# EAGLE design WT_ControlBoard (EAGLE 7.2.0)

## Sheet 1 of 5: Outpus
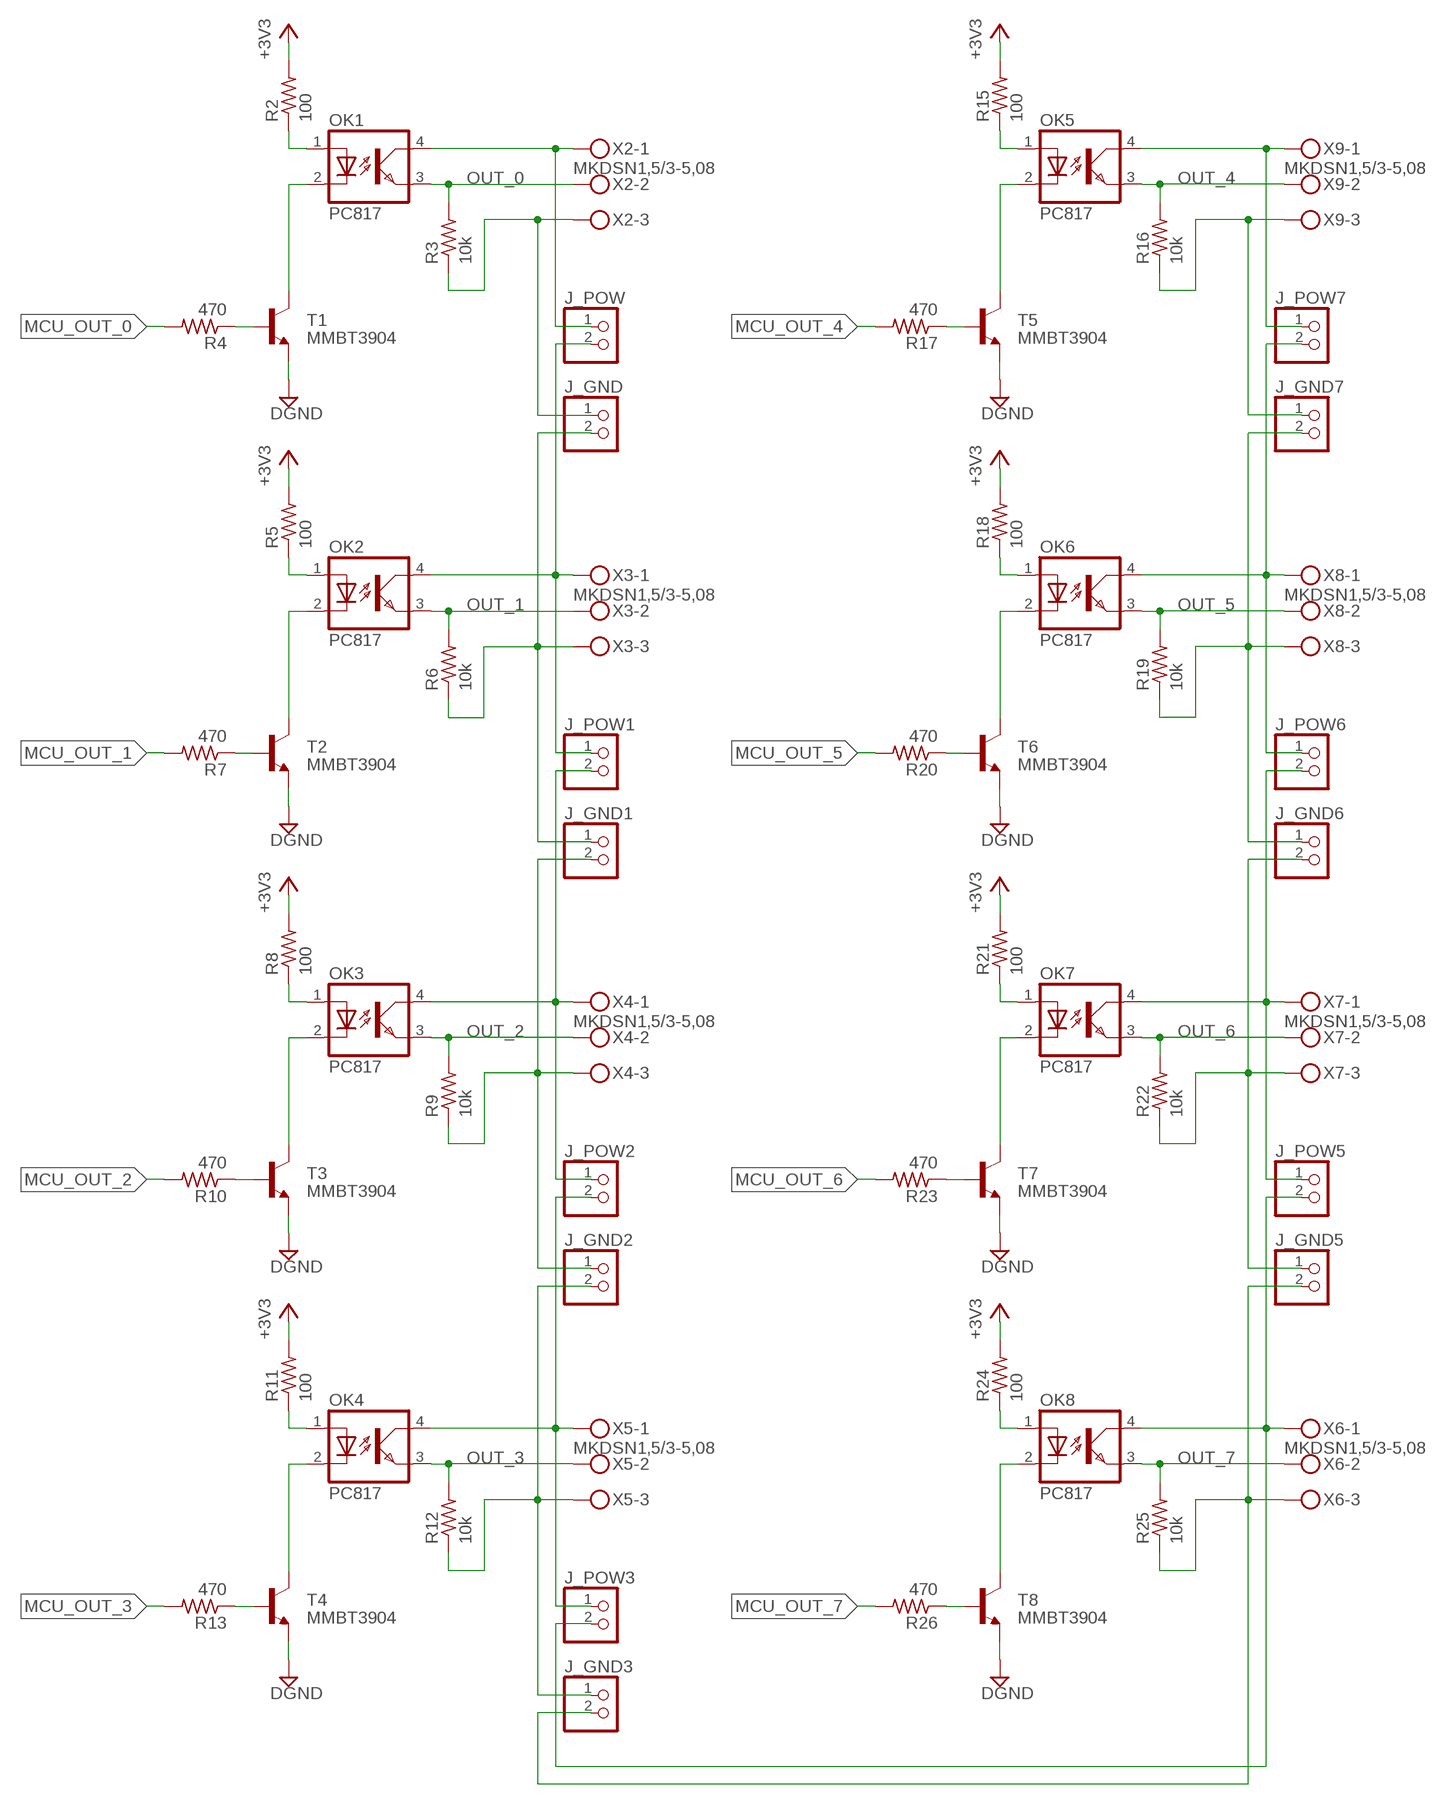
[diagram p0: schematic, sheet 1]

### Parts
J_GND  PINHD-1X2  [1X02]
J_GND1  PINHD-1X2  [1X02]
J_GND2  PINHD-1X2  [1X02]
J_GND3  PINHD-1X2  [1X02]
J_GND5  PINHD-1X2  [1X02]
J_GND6  PINHD-1X2  [1X02]
J_GND7  PINHD-1X2  [1X02]
J_POW  PINHD-1X2  [1X02]
J_POW1  PINHD-1X2  [1X02]
J_POW2  PINHD-1X2  [1X02]
J_POW3  PINHD-1X2  [1X02]
J_POW5  PINHD-1X2  [1X02]
J_POW6  PINHD-1X2  [1X02]
J_POW7  PINHD-1X2  [1X02]
OK1  PC817  [DIL04]
OK2  PC817  [DIL04]
OK3  PC817  [DIL04]
OK4  PC817  [DIL04]
OK5  PC817  [DIL04]
OK6  PC817  [DIL04]
OK7  PC817  [DIL04]
OK8  PC817  [DIL04]
R2  100  R-US_R0402  [R0402]
R3  10k  R-US_R0402  [R0402]
R4  470  R-US_0204/5  [0204/5]
R5  100  R-US_R0402  [R0402]
R6  10k  R-US_R0402  [R0402]
R7  470  R-US_0204/5  [0204/5]
R8  100  R-US_R0402  [R0402]
R9  10k  R-US_R0402  [R0402]
R10  470  R-US_0204/5  [0204/5]
R11  100  R-US_R0402  [R0402]
R12  10k  R-US_R0402  [R0402]
R13  470  R-US_0204/5  [0204/5]
R15  100  R-US_R0402  [R0402]
R16  10k  R-US_R0402  [R0402]
R17  470  R-US_0204/7  [0204/7]
R18  100  R-US_R0402  [R0402]
R19  10k  R-US_R0402  [R0402]
R20  470  R-US_0204/5  [0204/5]
R21  100  R-US_R0402  [R0402]
R22  10k  R-US_R0402  [R0402]
R23  470  R-US_0204/5  [0204/5]
R24  100  R-US_R0402  [R0402]
R25  10k  R-US_R0402  [R0402]
R26  470  R-US_0204/5  [0204/5]
T1  MMBT3904  MMBT3904LT1-NPN-SOT23-BEC  [SOT23-BEC]
T2  MMBT3904  MMBT3904LT1-NPN-SOT23-BEC  [SOT23-BEC]
T3  MMBT3904  MMBT3904LT1-NPN-SOT23-BEC  [SOT23-BEC]
T4  MMBT3904  MMBT3904LT1-NPN-SOT23-BEC  [SOT23-BEC]
T5  MMBT3904  MMBT3904LT1-NPN-SOT23-BEC  [SOT23-BEC]
T6  MMBT3904  MMBT3904LT1-NPN-SOT23-BEC  [SOT23-BEC]
T7  MMBT3904  MMBT3904LT1-NPN-SOT23-BEC  [SOT23-BEC]
T8  MMBT3904  MMBT3904LT1-NPN-SOT23-BEC  [SOT23-BEC]
X2  MKDSN1,5/3-5,08  [MKDSN1,5/3-5,08]
X3  MKDSN1,5/3-5,08  [MKDSN1,5/3-5,08]
X4  MKDSN1,5/3-5,08  [MKDSN1,5/3-5,08]
X5  MKDSN1,5/3-5,08  [MKDSN1,5/3-5,08]
X6  MKDSN1,5/3-5,08  [MKDSN1,5/3-5,08]
X7  MKDSN1,5/3-5,08  [MKDSN1,5/3-5,08]
X8  MKDSN1,5/3-5,08  [MKDSN1,5/3-5,08]
X9  MKDSN1,5/3-5,08  [MKDSN1,5/3-5,08]

### Nets
+3V3: R2.2 R5.2 R8.2 R11.2 R15.2 R18.2 R21.2 R24.2 ; also sheet 2,3,5
DGND: T1.E T2.E T3.E T4.E T5.E T6.E T7.E T8.E ; also sheet 2,3,4,5
MCU_OUT_0: R4.2 ; also sheet 5
MCU_OUT_1: R7.2 ; also sheet 5
MCU_OUT_2: R10.2 ; also sheet 5
MCU_OUT_3: R13.2 ; also sheet 5
MCU_OUT_4: R17.2 ; also sheet 5
MCU_OUT_5: R20.2 ; also sheet 5
MCU_OUT_6: R23.2 ; also sheet 5
MCU_OUT_7: R26.2 ; also sheet 5
N$1: OK1.2(C) T1.C
N$2: OK2.2(C) T2.C
N$3: R4.1 T1.B
N$4: OK1.1(A) R2.1
N$5: R7.1 T2.B
N$6: OK2.1(A) R5.1
N$7: OK3.2(C) T3.C
N$8: R10.1 T3.B
N$9: OK3.1(A) R8.1
N$10: OK4.2(C) T4.C
N$11: R13.1 T4.B
N$12: OK4.1(A) R11.1
N$13: OK5.2(C) T5.C
N$14: R17.1 T5.B
N$15: OK5.1(A) R15.1
N$16: OK6.2(C) T6.C
N$17: R20.1 T6.B
N$18: OK6.1(A) R18.1
N$19: OK7.2(C) T7.C
N$20: R23.1 T7.B
N$21: OK7.1(A) R21.1
N$22: OK8.2(C) T8.C
N$23: R26.1 T8.B
N$24: OK8.1(A) R24.1
N$70: J_GND6.1 J_GND7.2 R19.1 X8.3
N$76: J_GND.1 R3.1 X2.3
N$77: J_GND1.1 J_GND.2 R6.1 X3.3
N$78: J_POW1.1 J_POW.2 OK2.4(COL) X3.1
N$79: J_POW1.2 J_POW2.1 OK3.4(COL) X4.1
N$80: J_GND1.2 J_GND2.1 R9.1 X4.3
N$81: J_POW2.2 J_POW3.1 OK4.4(COL) X5.1
N$82: J_GND2.2 J_GND3.1 R12.1 X5.3
N$85: J_GND3.2 J_GND5.2 R25.1 X6.3
N$86: J_POW3.2 J_POW5.2 OK8.4(COL) X6.1
N$87: J_POW5.1 J_POW6.2 OK7.4(COL) X7.1
N$88: J_GND5.1 J_GND6.2 R22.1 X7.3
N$89: J_POW6.1 J_POW7.2 OK6.4(COL) X8.1
N$90: J_POW7.1 OK5.4(COL) X9.1
N$94: J_GND7.1 R16.1 X9.3
N$101: J_POW.1 OK1.4(COL) X2.1
OUT_0: OK1.3(EMIT) R3.2 X2.2
OUT_1: OK2.3(EMIT) R6.2 X3.2
OUT_2: OK3.3(EMIT) R9.2 X4.2
OUT_3: OK4.3(EMIT) R12.2 X5.2
OUT_4: OK5.3(EMIT) R16.2 X9.2
OUT_5: OK6.3(EMIT) R19.2 X8.2
OUT_6: OK7.3(EMIT) R22.2 X7.2
OUT_7: OK8.3(EMIT) R25.2 X6.2

## Sheet 2 of 5: Inputs
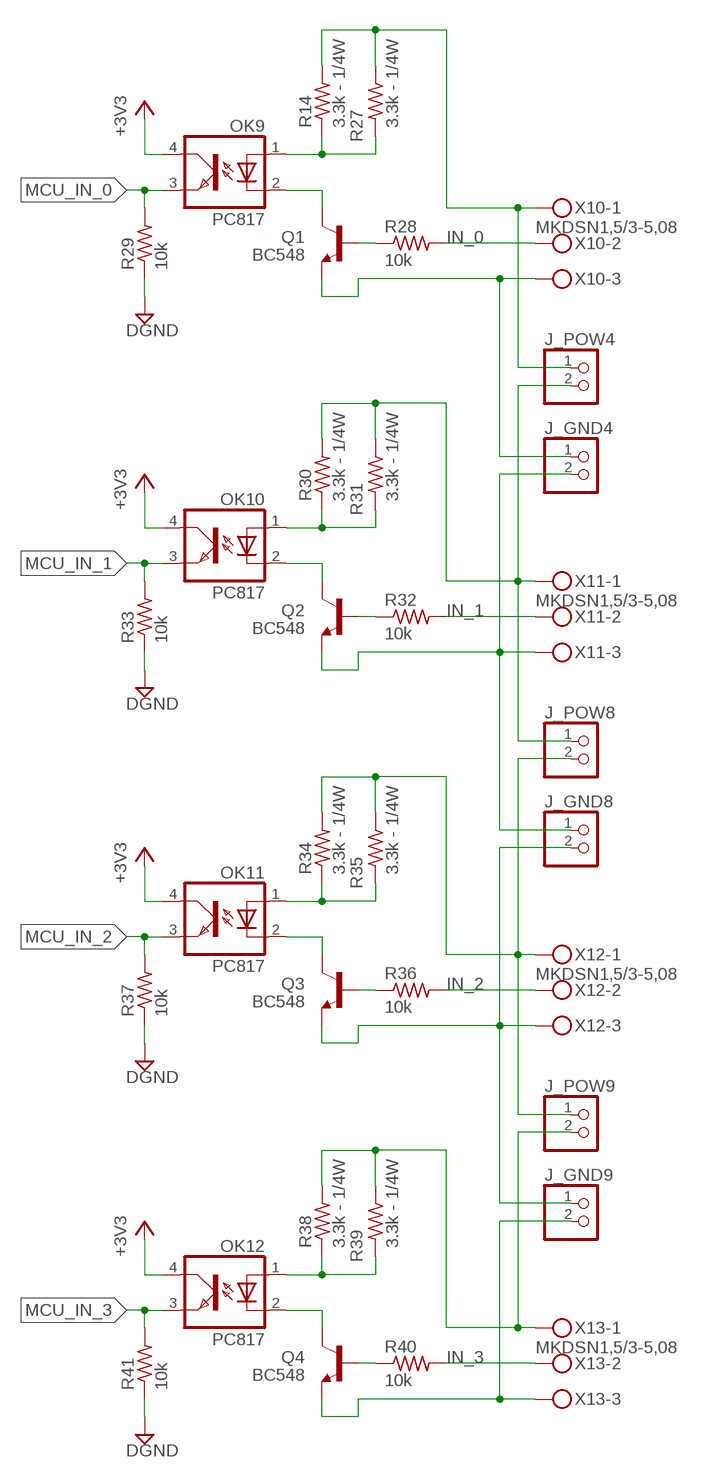
[diagram p1: schematic, sheet 2]

### Parts
J_GND4  PINHD-1X2  [1X02]
J_GND8  PINHD-1X2  [1X02]
J_GND9  PINHD-1X2  [1X02]
J_POW4  PINHD-1X2  [1X02]
J_POW8  PINHD-1X2  [1X02]
J_POW9  PINHD-1X2  [1X02]
OK9  PC817  [DIL04]
OK10  PC817  [DIL04]
OK11  PC817  [DIL04]
OK12  PC817  [DIL04]
Q1  BC548  [TO92-EBC]
Q2  BC548  [TO92-EBC]
Q3  BC548  [TO92-EBC]
Q4  BC548  [TO92-EBC]
R14  3.3k - 1/4W  R-US_0204/2V  [0204V]
R27  3.3k - 1/4W  R-US_0204/2V  [0204V]
R28  10k  R-US_0204/5  [0204/5]
R29  10k  R-US_R0402  [R0402]
R30  3.3k - 1/4W  R-US_0204/2V  [0204V]
R31  3.3k - 1/4W  R-US_0204/2V  [0204V]
R32  10k  R-US_0204/5  [0204/5]
R33  10k  R-US_R0402  [R0402]
R34  3.3k - 1/4W  R-US_0204/2V  [0204V]
R35  3.3k - 1/4W  R-US_0204/2V  [0204V]
R36  10k  R-US_0204/5  [0204/5]
R37  10k  R-US_R0402  [R0402]
R38  3.3k - 1/4W  R-US_0204/2V  [0204V]
R39  3.3k - 1/4W  R-US_0204/2V  [0204V]
R40  10k  R-US_0204/5  [0204/5]
R41  10k  R-US_R0402  [R0402]
X10  MKDSN1,5/3-5,08  [MKDSN1,5/3-5,08]
X11  MKDSN1,5/3-5,08  [MKDSN1,5/3-5,08]
X12  MKDSN1,5/3-5,08  [MKDSN1,5/3-5,08]
X13  MKDSN1,5/3-5,08  [MKDSN1,5/3-5,08]

### Nets
+3V3: OK9.4(COL) OK10.4(COL) OK11.4(COL) OK12.4(COL) ; also sheet 1,3,5
DGND: R29.1 R33.1 R37.1 R41.1 ; also sheet 1,3,4,5
IN_0: R28.2 X10.2
IN_1: R32.2 X11.2
IN_2: R36.2 X12.2
IN_3: R40.2 X13.2
MCU_IN_0: OK9.3(EMIT) R29.2 ; also sheet 5
MCU_IN_1: OK10.3(EMIT) R33.2 ; also sheet 5
MCU_IN_2: OK11.3(EMIT) R37.2 ; also sheet 5
MCU_IN_3: OK12.3(EMIT) R41.2 ; also sheet 5
N$25: OK9.1(A) R14.1 R27.2
N$26: OK9.2(C) Q1.C
N$27: Q1.B R28.1
N$28: OK10.1(A) R30.1 R31.2
N$29: OK10.2(C) Q2.C
N$30: Q2.B R32.1
N$31: OK11.1(A) R34.1 R35.2
N$32: OK11.2(C) Q3.C
N$33: Q3.B R36.1
N$34: OK12.1(A) R38.1 R39.2
N$35: OK12.2(C) Q4.C
N$36: Q4.B R40.1
N$83: J_GND4.2 J_GND8.1 Q2.E X11.3
N$84: J_GND9.2 Q4.E X13.3
N$91: J_POW9.2 R38.2 R39.1 X13.1
N$92: J_POW4.2 J_POW8.1 R30.2 R31.1 X11.1
N$93: J_GND8.2 J_GND9.1 Q3.E X12.3
N$95: J_POW8.2 J_POW9.1 R34.2 R35.1 X12.1
N$96: J_GND4.1 Q1.E X10.3
N$97: J_POW4.1 R14.2 R27.1 X10.1

## Sheet 3 of 5: Bidirectional
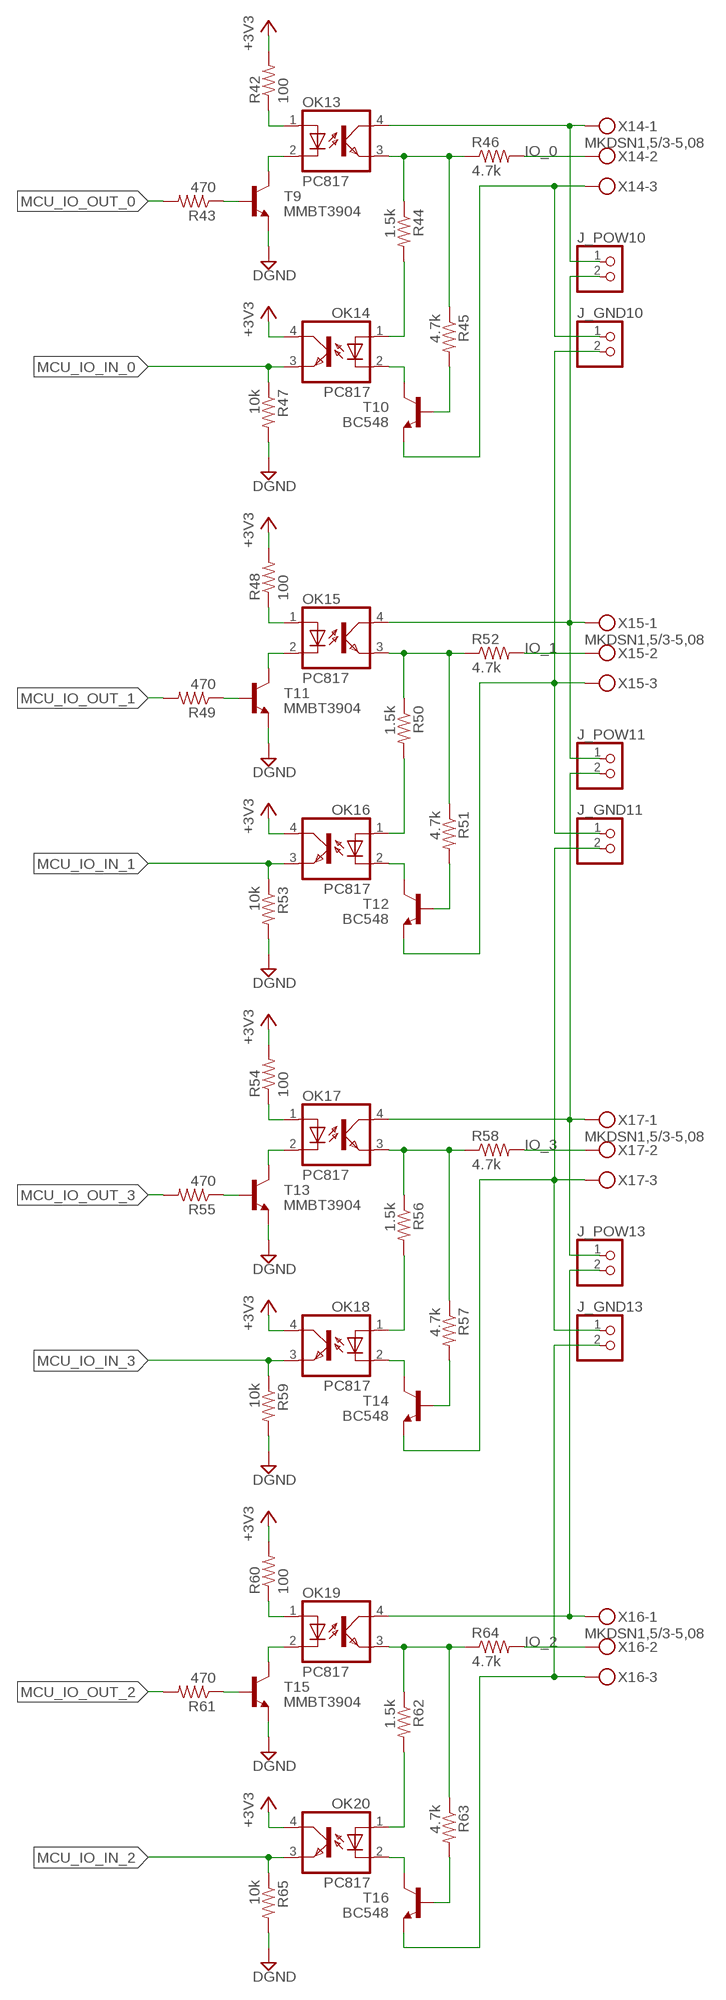
[diagram p2: schematic, sheet 3]

### Parts
J_GND10  PINHD-1X2  [1X02]
J_GND11  PINHD-1X2  [1X02]
J_GND13  PINHD-1X2  [1X02]
J_POW10  PINHD-1X2  [1X02]
J_POW11  PINHD-1X2  [1X02]
J_POW13  PINHD-1X2  [1X02]
OK13  PC817  [DIL04]
OK14  PC817  [DIL04]
OK15  PC817  [DIL04]
OK16  PC817  [DIL04]
OK17  PC817  [DIL04]
OK18  PC817  [DIL04]
OK19  PC817  [DIL04]
OK20  PC817  [DIL04]
R42  100  R-US_0204/7  [0204/7]
R43  470  R-US_R0402  [R0402]
R44  1.5k  R-US_0204/5  [0204/5]
R45  4.7k  R-US_0204/2V  [0204V]
R46  4.7k  R-US_0204/2V  [0204V]
R47  10k  R-US_0204/5  [0204/5]
R48  100  R-US_0204/7  [0204/7]
R49  470  R-US_R0402  [R0402]
R50  1.5k  R-US_0204/5  [0204/5]
R51  4.7k  R-US_0204/2V  [0204V]
R52  4.7k  R-US_0204/2V  [0204V]
R53  10k  R-US_0204/5  [0204/5]
R54  100  R-US_0204/7  [0204/7]
R55  470  R-US_R0402  [R0402]
R56  1.5k  R-US_0204/5  [0204/5]
R57  4.7k  R-US_0204/2V  [0204V]
R58  4.7k  R-US_0204/2V  [0204V]
R59  10k  R-US_0204/5  [0204/5]
R60  100  R-US_0204/7  [0204/7]
R61  470  R-US_R0402  [R0402]
R62  1.5k  R-US_0204/5  [0204/5]
R63  4.7k  R-US_0204/2V  [0204V]
R64  4.7k  R-US_0204/2V  [0204V]
R65  10k  R-US_0204/5  [0204/5]
T9  MMBT3904  MMBT3904LT1-NPN-SOT23-BEC  [SOT23-BEC]
T10  BC548  BC548-NPN-TO92-CBE  [TO92-CBE]
T11  MMBT3904  MMBT3904LT1-NPN-SOT23-BEC  [SOT23-BEC]
T12  BC548  BC548-NPN-TO92-CBE  [TO92-CBE]
T13  MMBT3904  MMBT3904LT1-NPN-SOT23-BEC  [SOT23-BEC]
T14  BC548  BC548-NPN-TO92-CBE  [TO92-CBE]
T15  MMBT3904  MMBT3904LT1-NPN-SOT23-BEC  [SOT23-BEC]
T16  BC548  BC548-NPN-TO92-CBE  [TO92-CBE]
X14  MKDSN1,5/3-5,08  [MKDSN1,5/3-5,08]
X15  MKDSN1,5/3-5,08  [MKDSN1,5/3-5,08]
X16  MKDSN1,5/3-5,08  [MKDSN1,5/3-5,08]
X17  MKDSN1,5/3-5,08  [MKDSN1,5/3-5,08]

### Nets
+3V3: OK14.4(COL) OK16.4(COL) OK18.4(COL) OK20.4(COL) R42.2 R48.2 R54.2 R60.2 ; also sheet 1,2,5
DGND: R47.2 R53.2 R59.2 R65.2 T9.E T11.E T13.E T15.E ; also sheet 1,2,4,5
IO_0: R46.2 X14.2
IO_1: R52.2 X15.2
IO_2: R64.2 X16.2
IO_3: R58.2 X17.2
MCU_IO_IN_0: OK14.3(EMIT) R47.1 ; also sheet 5
MCU_IO_IN_1: OK16.3(EMIT) R53.1 ; also sheet 5
MCU_IO_IN_2: OK20.3(EMIT) R65.1 ; also sheet 5
MCU_IO_IN_3: OK18.3(EMIT) R59.1 ; also sheet 5
MCU_IO_OUT_0: R43.2 ; also sheet 5
MCU_IO_OUT_1: R49.2 ; also sheet 5
MCU_IO_OUT_2: R61.2 ; also sheet 5
MCU_IO_OUT_3: R55.2 ; also sheet 5
N$37: OK14.2(C) T10.C
N$38: OK13.2(C) T9.C
N$39: R43.1 T9.B
N$40: OK13.1(A) R42.1
N$41: OK13.3(EMIT) R44.1 R45.1 R46.1
N$42: OK14.1(A) R44.2
N$43: R45.2 T10.B
N$44: OK16.2(C) T12.C
N$45: OK15.2(C) T11.C
N$46: R49.1 T11.B
N$47: OK15.1(A) R48.1
N$48: OK15.3(EMIT) R50.1 R51.1 R52.1
N$49: OK16.1(A) R50.2
N$50: R51.2 T12.B
N$51: OK18.2(C) T14.C
N$52: OK17.2(C) T13.C
N$53: R55.1 T13.B
N$54: OK17.1(A) R54.1
N$55: OK17.3(EMIT) R56.1 R57.1 R58.1
N$56: OK18.1(A) R56.2
N$57: R57.2 T14.B
N$58: OK20.2(C) T16.C
N$59: OK19.2(C) T15.C
N$60: R61.1 T15.B
N$61: OK19.1(A) R60.1
N$62: OK19.3(EMIT) R62.1 R63.1 R64.1
N$63: OK20.1(A) R62.2
N$64: R63.2 T16.B
N$98: J_POW11.2 J_POW13.1 OK17.4(COL) X17.1
N$99: J_GND13.2 T16.E X16.3
N$100: J_POW10.1 OK13.4(COL) X14.1
N$102: J_GND10.1 T10.E X14.3
N$103: J_POW10.2 J_POW11.1 OK15.4(COL) X15.1
N$104: J_GND10.2 J_GND11.1 T12.E X15.3
N$105: J_GND11.2 J_GND13.1 T14.E X17.3
N$106: J_POW13.2 OK19.4(COL) X16.1

## Sheet 4 of 5: Analog IO
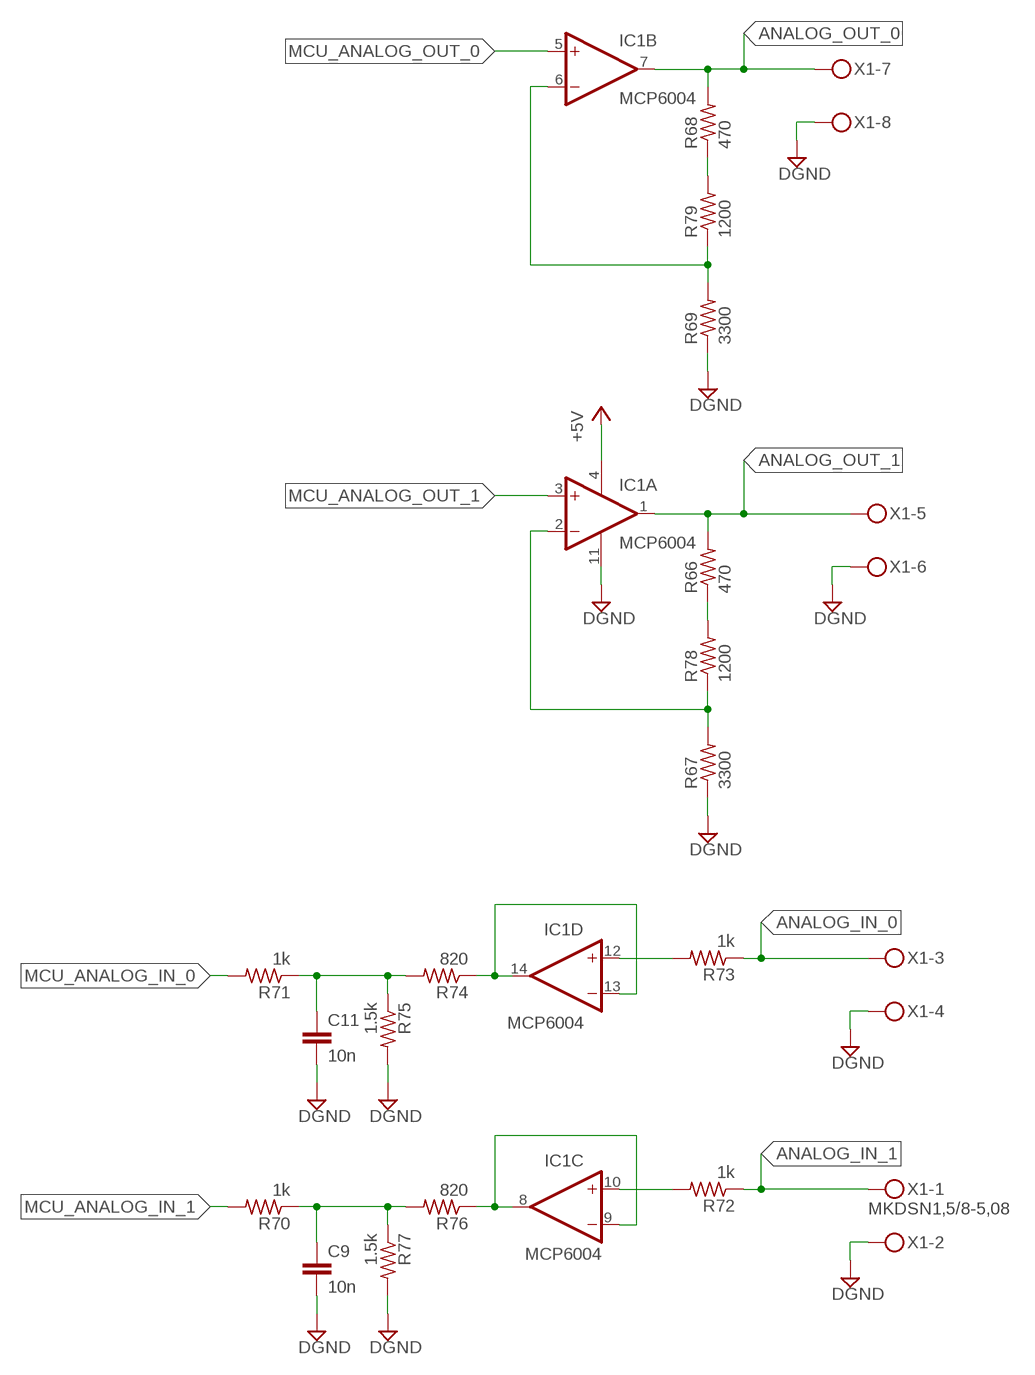
[diagram p3: schematic, sheet 4]

### Parts
C9  10n  C-EUC0402  [C0402]
C11  10n  C-EUC0402  [C0402]
IC1  MCP6004  LM324D  [SO14]
R66  470  R-US_R0402  [R0402]
R67  3300  R-US_R0402  [R0402]
R68  470  R-US_R0402  [R0402]
R69  3300  R-US_R0402  [R0402]
R70  1k  R-US_R0402  [R0402]
R71  1k  R-US_R0402  [R0402]
R72  1k  R-US_0204/2V  [0204V]
R73  1k  R-US_0204/7  [0204/7]
R74  820  R-US_R0402  [R0402]
R75  1.5k  R-US_R0402  [R0402]
R76  820  R-US_R0402  [R0402]
R77  1.5k  R-US_R0402  [R0402]
R78  1200  R-US_R0402  [R0402]
R79  1200  R-US_R0402  [R0402]
X1  MKDSN1,5/8-5,08  [MKDSN1,5/8-5,08]

### Nets
+5V: IC1.4(P:V+) ; also sheet 5
ANALOG_IN_0: R73.1 X1.3
ANALOG_IN_1: R72.1 X1.1
ANALOG_OUT_0: IC1.7(B:OUT) R68.2 X1.7
ANALOG_OUT_1: IC1.1(A:OUT) R66.2 X1.5
DGND: C9.2 C11.2 IC1.11(P:V-) R67.1 R69.1 R75.2 R77.2 X1.2 X1.4 X1.6 X1.8 ; also sheet 1,2,3,5
MCU_ANALOG_IN_0: R71.2 ; also sheet 5
MCU_ANALOG_IN_1: R70.2 ; also sheet 5
MCU_ANALOG_OUT_0: IC1.5(B:+IN) ; also sheet 5
MCU_ANALOG_OUT_1: IC1.3(A:+IN) ; also sheet 5
N$65: IC1.6(B:-IN) R69.2 R79.1
N$66: IC1.2(A:-IN) R67.2 R78.1
N$67: IC1.10(C:+IN) R72.2
N$68: IC1.12(D:+IN) R73.2
N$69: IC1.8(C:OUT) IC1.9(C:-IN) R76.1
N$71: IC1.13(D:-IN) IC1.14(D:OUT) R74.1
N$72: C9.1 R70.1 R76.2 R77.1
N$73: C11.1 R71.1 R74.2 R75.1
N$74: R66.1 R78.2
N$75: R68.1 R79.2

## Sheet 5 of 5: Power
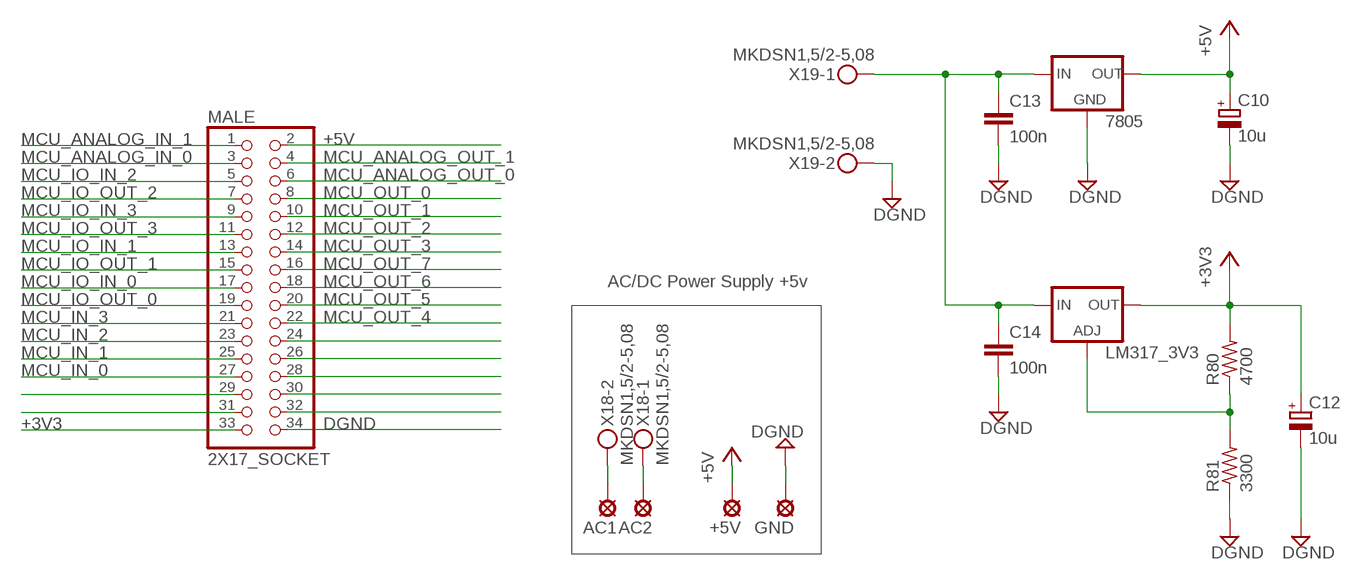
[diagram p4: schematic, sheet 5]

### Parts
7805  78XXS  [78XXS]
+5V  LSP10  [LSP10]
AC1  LSP10  [LSP10]
AC2  LSP10  [LSP10]
C10  10u  CPOL-EUE1.8-4  [E1,8-4]
C12  10u  CPOL-EUE1.8-4  [E1,8-4]
C13  100n  C-EUC1206  [C1206]
C14  100n  C-EUC1206  [C1206]
GND  LSP10  [LSP10]
LM317_3V3  LM317TS  [317TS]
MALE  2X17_SOCKET  [2X17_SOCKET]
R80  4700  R-US_0204/2V  [0204V]
R81  3300  R-US_0204/2V  [0204V]
X18  MKDSN1,5/2-5,08  [MKDSN1,5/2-5,08]
X19  MKDSN1,5/2-5,08  [MKDSN1,5/2-5,08]

### Nets
+3V3: C12.+ LM317_3V3.2(OUT) MALE.33 R80.2 ; also sheet 1,2,3
+5V: 7805.OUT +5V.MP C10.+ MALE.2 ; also sheet 4
DGND: 7805.GND C10.- C12.- C13.2 C14.2 GND.MP MALE.34 R81.1 X19.2 ; also sheet 1,2,3,4
MCU_ANALOG_IN_0: MALE.3 ; also sheet 4
MCU_ANALOG_IN_1: MALE.1 ; also sheet 4
MCU_ANALOG_OUT_0: MALE.6 ; also sheet 4
MCU_ANALOG_OUT_1: MALE.4 ; also sheet 4
MCU_IN_0: MALE.27 ; also sheet 2
MCU_IN_1: MALE.25 ; also sheet 2
MCU_IN_2: MALE.23 ; also sheet 2
MCU_IN_3: MALE.21 ; also sheet 2
MCU_IO_IN_0: MALE.17 ; also sheet 3
MCU_IO_IN_1: MALE.13 ; also sheet 3
MCU_IO_IN_2: MALE.5 ; also sheet 3
MCU_IO_IN_3: MALE.9 ; also sheet 3
MCU_IO_OUT_0: MALE.19 ; also sheet 3
MCU_IO_OUT_1: MALE.15 ; also sheet 3
MCU_IO_OUT_2: MALE.7 ; also sheet 3
MCU_IO_OUT_3: MALE.11 ; also sheet 3
MCU_OUT_0: MALE.8 ; also sheet 1
MCU_OUT_1: MALE.10 ; also sheet 1
MCU_OUT_2: MALE.12 ; also sheet 1
MCU_OUT_3: MALE.14 ; also sheet 1
MCU_OUT_4: MALE.22 ; also sheet 1
MCU_OUT_5: MALE.20 ; also sheet 1
MCU_OUT_6: MALE.18 ; also sheet 1
MCU_OUT_7: MALE.16 ; also sheet 1
N$107: AC1.MP X18.2
N$108: AC2.MP X18.1
N$110: 7805.IN C13.1 C14.1 LM317_3V3.3(IN) X19.1
N$111: LM317_3V3.1(ADJ) R80.1 R81.2
N$123: MALE.29
N$124: MALE.31
N$137: MALE.24
N$138: MALE.26
N$139: MALE.28
N$140: MALE.30
N$141: MALE.32

### Notes on the sheet
- AC/DC Power Supply +5v

## Library data of the parts
7805 = v-reg:78XXS: VOLTAGE REGULATOR
+5V AC1 AC2 GND = solpad:LSP10: SOLDER PAD drill 1.0 mm, distributor Buerklin, 12H555
C9 C11 C13 C14 = rcl:C-EU: CAPACITOR, European symbol
C10 C12 = rcl:CPOL-EU: POLARIZED CAPACITOR, European symbol
IC1 = linear:LM324: OP AMP
J_GND J_GND1-J_GND11 J_GND13 J_POW J_POW1-J_POW11 J_POW13 = pinhead:PINHD-1X2: PIN HEADER
LM317_3V3 = v-reg:LM317TS: VOLTAGE REGULATOR
MALE = CardEdgePads:2X17_SOCKET
OK1-OK20 = optocoupler:PC817: SHARP OPTO COUPLER; MPN: PC817X4J000F; OC_FARNELL: 9707727; OC_NEWARK: 97K7059
Q1-Q4 = transistor-npn:BC548*: NPN Transistor
R2-R81 = rcl:R-US_: RESISTOR, American symbol
T1-T16 = transistor:*-NPN-: NPN Transistror BF959 corrected 2008.03.06
X1 = con-phoenix-508:MKDSN1,5/8-5,08: MKDSN 1,5/ 8-5,08 Printklemme Nennstrom: 13,5 A Nennspannung: 250 V Rastermaß: 5,08 mm Polzahl: 8 Anschlussart: Schraubanschluss Montage: Löten Anschlussrichtung Leiter/Platine: 0 ° Artikelnummer: 1729186 Source: http://eshop.phoenixcontact.com .. 1729186.pdf
X2-X17 = con-phoenix-508:MKDSN1,5/3-5,08: MKDSN 1,5/ 3-5,08 Printklemme Nennstrom: 13,5 A Nennspannung: 250 V Rastermaß: 5,08 mm Polzahl: 3 Anschlussart: Schraubanschluss Montage: Löten Anschlussrichtung Leiter/Platine: 0 ° Artikelnummer: 1729131 Source: http://eshop.phoenixcontact.com .. 1729131.pdf
X18 X19 = con-phoenix-508:MKDSN1,5/2-5,08: MKDSN 1,5/ 2-5,08 Printklemme Nennstrom: 13,5 A Nennspannung: 250 V Rastermaß: 5,08 mm Polzahl: 2 Anschlussart: Schraubanschluss Montage: Löten Anschlussrichtung Leiter/Platine: 0 ° Artikelnummer: 1729128 Source: http://eshop.phoenixcontact.com .. 1729128.pdf

## Board
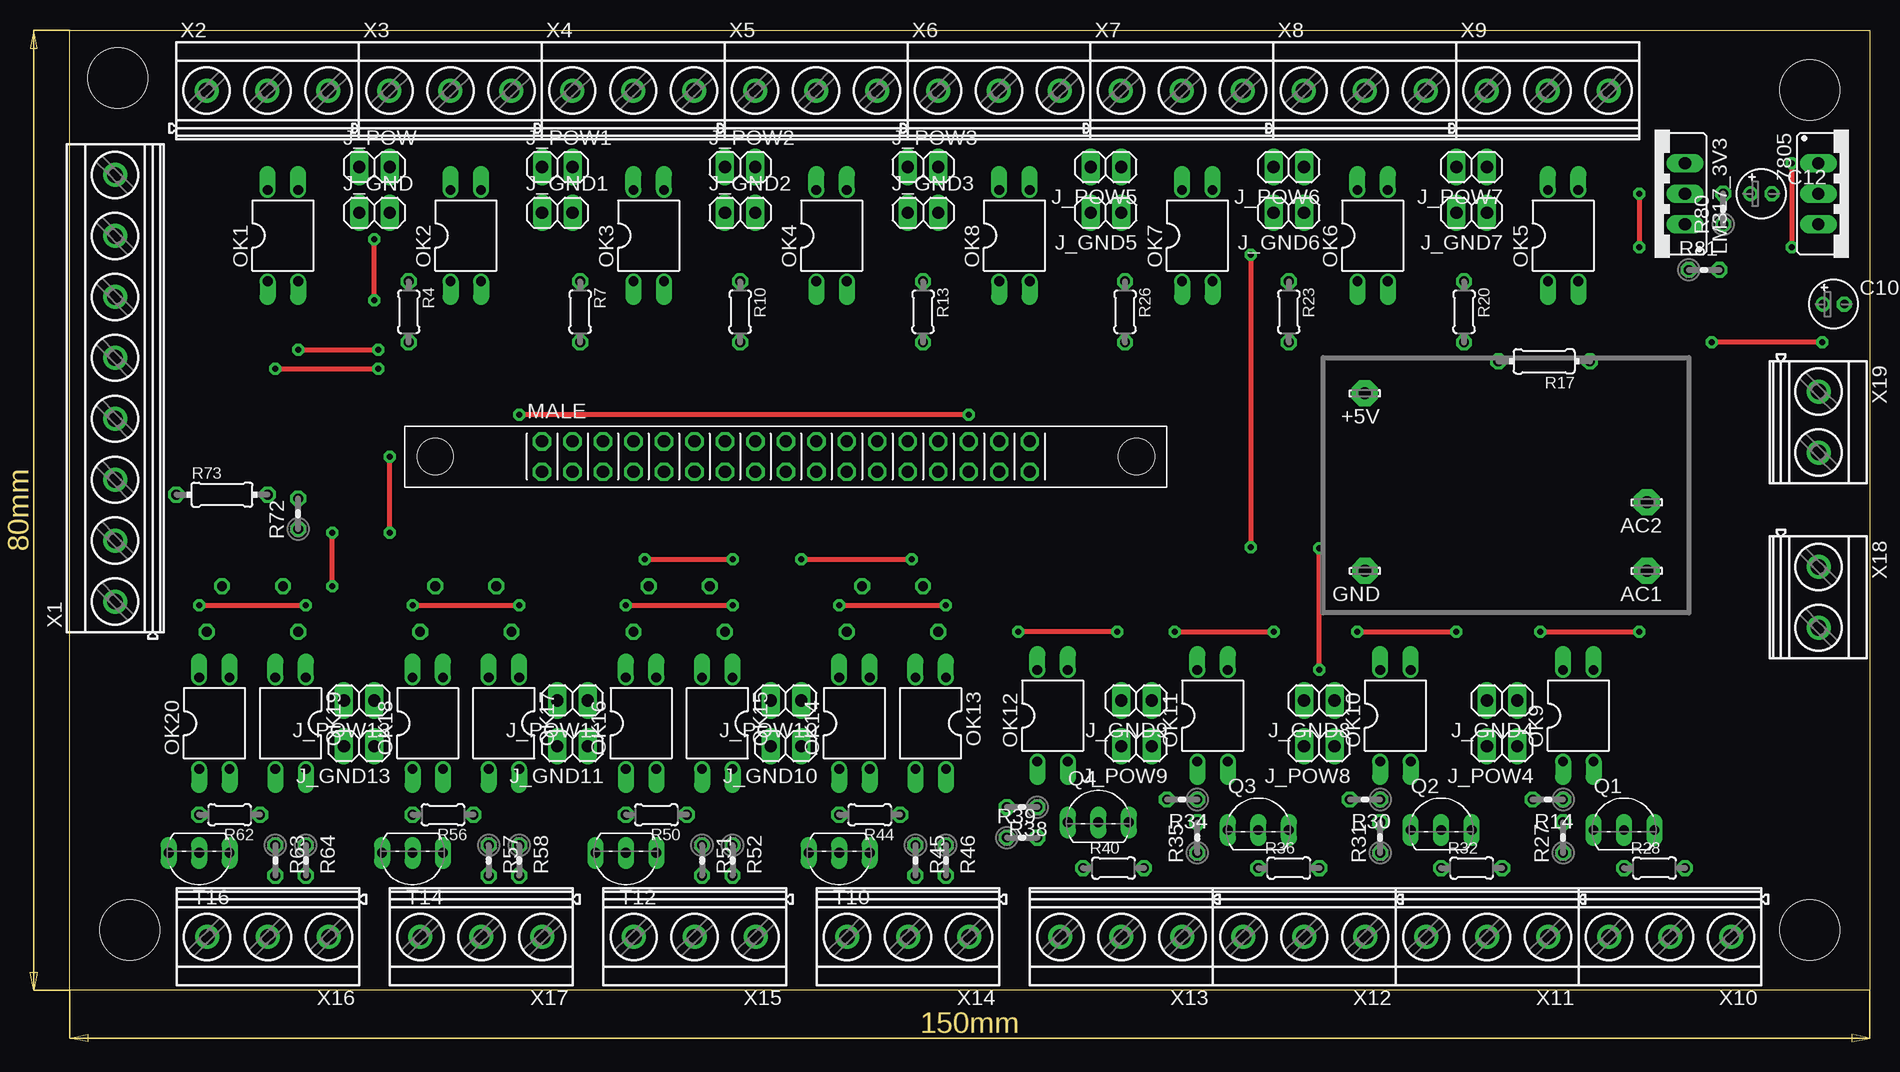
[diagram p5: board, top side]
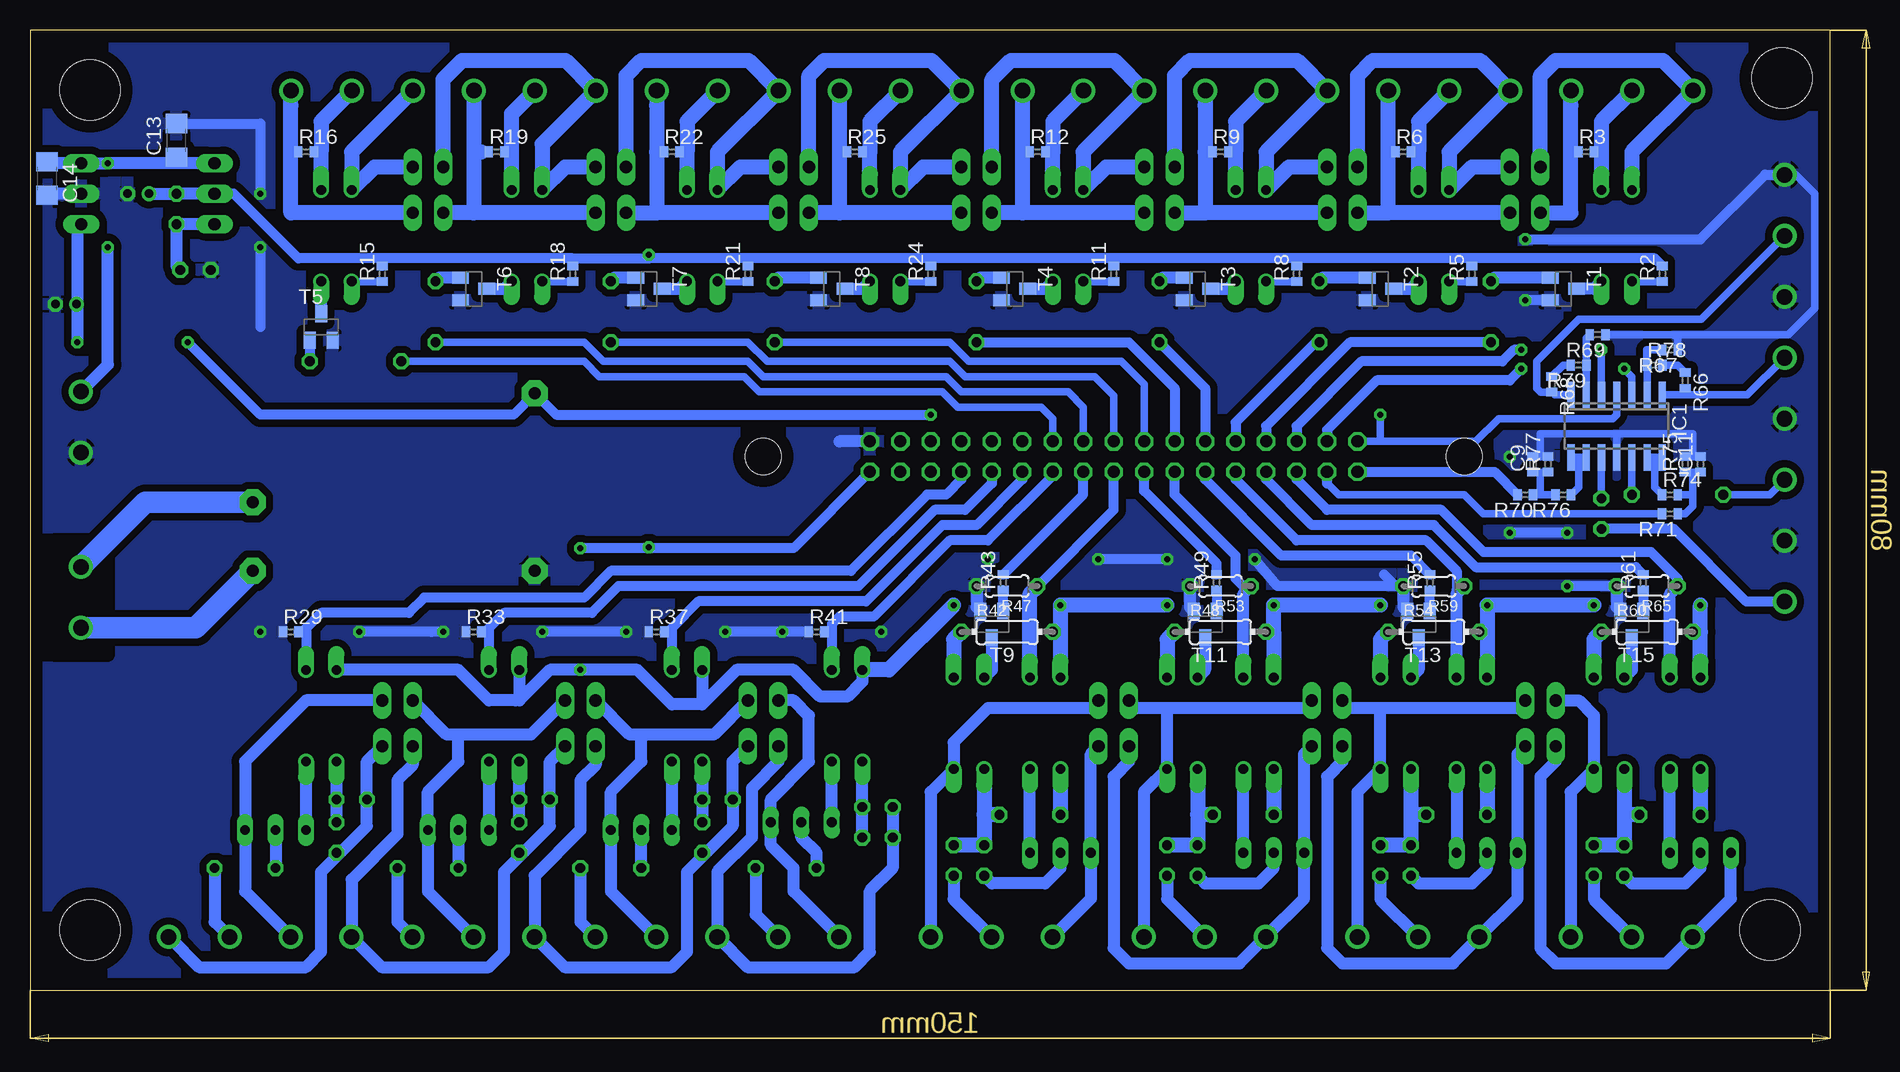
[diagram p6: board, bottom side, seen from below]

Size 150 x 80 mm. Coordinates in mm from the lower left corner, seen from the top.
Outline: 0,0 0,80 150,80 150,0 0,0
Copper layers (1*16): Top 0.035mm / dielectric 1.5mm / Bottom 0.035mm
Design rules "default": minimum track width 10mil, minimum drill 24mil, track to track 8mil, track to pad 8mil, pad to pad 8mil, via to via 8mil, smd to smd 8mil, copper to edge 40mil, drill to drill 8mil, minimum pad ring 10mil, minimum via ring 8mil, stop-mask expansion 4mil, vias tented up to drill 0mil, thermal gap 10mil
Holes 5 mm at 4,76 145,75 145,5 5,5
bRestrict: area 143.5,27.9 to 148,37.5

### Footprints (pad centres in the part's own frame; a part is rotated, then mirrored left to right if it is on the bottom)
78XXS = drill 1.016 long: GND 0,-2.54; IN -2.54,-2.54; OUT 2.54,-2.54
LSP10 = drill 1.016 pad 2.159 octagon: MP 0,0
C0402 = smd 0.7 x 0.9: 1 -0.65,0; 2 0.65,0
E1,8-4 = drill 0.711 pad 1.168: + -0.889,0 | drill 0.711 pad 1.168 octagon: - 0.889,0
C1206 = smd 1.6 x 1.8: 1 -1.4,0; 2 1.4,0
SO14 = smd 0.6 x 2.2: 1 -3.81,-2.6; 2 -2.54,-2.6; 3 -1.27,-2.6; 4 0,-2.6; 5 1.27,-2.6; 6 2.54,-2.6; 7 3.81,-2.6; 8 3.81,2.6; 9 2.54,2.6; 10 1.27,2.6; 11 0,2.6; 12 -1.27,2.6; 13 -2.54,2.6; 14 -3.81,2.6
1X02 = drill 1.016 long: 1 -1.27,0; 2 1.27,0
317TS = drill 1.016 long: 1 -2.54,-2.54; 2 0,-2.54; 3 2.54,-2.54
2X17_SOCKET = drill 1.016 octagon: 1 -19.05,-1.27; 2 -19.05,1.27; 3 -16.51,-1.27; 4 -16.51,1.27; 5 -13.97,-1.27; 6 -13.97,1.27; 7 -11.43,-1.27; 8 -11.43,1.27; 9 -8.89,-1.27; 10 -8.89,1.27; 11 -6.35,-1.27; 12 -6.35,1.27; 13 -3.81,-1.27; 14 -3.81,1.27; 15 -1.27,-1.27; 16 -1.27,1.27; 17 1.27,-1.27; 18 1.27,1.27; 19 3.81,-1.27; 20 3.81,1.27; 21 6.35,-1.27; 22 6.35,1.27; 23 8.89,-1.27; 24 8.89,1.27; 25 11.43,-1.27; 26 11.43,1.27; 27 13.97,-1.27; 28 13.97,1.27; 29 16.51,-1.27; 30 16.51,1.27; 31 19.05,-1.27; 32 19.05,1.27; 33 21.59,-1.27; 34 21.59,1.27 | hole 3: -27.94,0; 30.48,0
DIL04 = drill 0.813 offset: 1 -1.27,-3.81; 2 1.27,-3.81; 3 1.27,3.81; 4 -1.27,3.81
TO92-EBC = drill 0.813 long: B 0,-1.27; C -2.54,-1.27; E 2.54,-1.27
R0402 = smd 0.7 x 0.9: 1 -0.65,0; 2 0.65,0
0204/5 = drill 0.813 octagon: 1 -2.54,0; 2 2.54,0
0204V = drill 0.813 octagon: 1 -1.27,0; 2 1.27,0
0204/7 = drill 0.813 octagon: 1 -3.81,0; 2 3.81,0
SOT23-BEC = smd 1 x 1.4: B -0.95,-1.1; C 0,1.1; E 0.95,-1.1
TO92-CBE = drill 0.813 long: B 0,0; C -2.54,0; E 2.54,0
MKDSN1,5/8-5,08 = drill 1.3 pad 2: 1 -17.801,0.025; 2 -12.721,0.025; 3 -7.641,0.025; 4 -2.561,0.025; 5 2.519,0.025; 6 7.599,0.025; 7 12.679,0.025; 8 17.759,0.025
MKDSN1,5/3-5,08 = drill 1.3 pad 2: 1 -7.641,0.025; 2 -2.561,0.025; 3 2.519,0.025
MKDSN1,5/2-5,08 = drill 1.3 pad 2: 1 -2.561,0.025; 2 2.519,0.025

### Placement (x,y rotation side)
7805  148.27,66.36 270 top
+5V  107.93,49.72 180 top
AC1  131.44,34.92 180 top
AC2  131.44,40.64 180 top
C9  24.77,43.81 90 bottom
C10  147,57.15 0 top
C11  10.79,43.81 90 bottom
C12  140.97,66.36 0 top
C13  137.79,70.8 90 bottom
C14  148.59,67.63 270 bottom
GND  107.95,34.92 180 top
IC1  17.78,46.99 180 bottom
J_GND  25.4,64.77 0 top
J_GND1  40.64,64.77 0 top
J_GND2  55.88,64.77 0 top
J_GND3  71.12,64.77 0 top
J_GND4  119.38,24.13 180 top
J_GND5  86.36,64.77 180 top
J_GND6  101.6,64.77 180 top
J_GND7  116.84,64.77 180 top
J_GND8  104.14,24.13 180 top
J_GND9  88.9,24.13 180 top
J_GND10  59.69,20.32 180 top
J_GND11  41.91,20.32 180 top
J_GND13  24.13,20.32 180 top
J_POW  25.4,68.58 0 top
J_POW1  40.64,68.58 0 top
J_POW2  55.88,68.58 0 top
J_POW3  71.12,68.58 0 top
J_POW4  119.38,20.32 180 top
J_POW5  86.36,68.58 180 top
J_POW6  101.6,68.58 180 top
J_POW7  116.84,68.58 180 top
J_POW8  104.14,20.32 180 top
J_POW9  88.9,20.32 180 top
J_POW10  59.69,24.13 180 top
J_POW11  41.91,24.13 180 top
J_POW13  24.13,24.13 180 top
LM317_3V3  132.08,66.36 90 top
MALE  58.42,44.45 0 top
OK1  17.78,62.87 0 top
OK2  33.02,62.87 0 top
OK3  48.26,62.87 0 top
OK4  63.5,62.87 0 top
OK5  124.46,62.87 0 top
OK6  108.58,62.87 0 top
OK7  93.98,62.87 0 top
OK8  78.74,62.87 0 top
OK9  125.73,22.86 0 top
OK10  110.49,22.86 0 top
OK11  95.25,22.86 0 top
OK12  81.92,22.86 0 top
OK13  71.75,22.23 180 top
OK14  65.41,22.23 0 top
OK15  53.98,22.23 180 top
OK16  47.62,22.23 0 top
OK17  36.2,22.23 180 top
OK18  29.84,22.23 0 top
OK19  18.41,22.23 180 top
OK20  12.06,22.23 0 top
Q1  129.54,14.61 0 top
Q2  114.3,14.61 0 top
Q3  99.06,14.61 0 top
Q4  85.72,15.24 0 top
R2  13.97,59.69 90 bottom
R3  20.32,69.85 0 bottom
R4  28.26,56.52 270 top
R5  29.84,59.69 90 bottom
R6  35.56,69.85 0 bottom
R7  42.55,56.52 270 top
R8  44.45,59.69 90 bottom
R9  50.8,69.85 0 bottom
R10  55.88,56.52 270 top
R11  59.69,59.69 90 bottom
R12  66.04,69.85 0 bottom
R13  71.12,56.52 270 top
R14  123.19,15.88 180 top
R15  120.65,59.69 90 bottom
R16  127,69.85 0 bottom
R17  122.87,52.39 180 top
R18  104.78,59.69 90 bottom
R19  111.12,69.85 0 bottom
R20  116.2,56.52 270 top
R21  90.17,59.69 90 bottom
R22  96.52,69.85 0 bottom
R23  101.6,56.52 270 top
R24  74.93,59.69 90 bottom
R25  81.28,69.85 0 bottom
R26  87.95,56.52 270 top
R27  124.46,12.7 90 top
R28  132.08,10.16 0 top
R29  128.27,29.84 0 bottom
R30  107.95,15.88 180 top
R31  109.22,12.7 90 top
R32  116.84,10.16 0 top
R33  113.03,29.84 0 bottom
R34  92.71,15.88 180 top
R35  93.98,12.7 90 top
R36  101.6,10.16 0 top
R37  97.79,29.84 0 bottom
R38  79.38,15.24 180 top
R39  79.38,12.7 0 top
R40  87,10.16 0 top
R41  84.45,29.84 0 bottom
R42  68.58,29.84 0 bottom
R43  68.9,33.97 90 bottom
R44  66.67,14.61 180 top
R45  70.48,10.79 270 top
R46  73.03,10.79 270 top
R47  68.58,33.66 180 bottom
R48  50.8,29.84 0 bottom
R49  51.12,33.97 90 bottom
R50  48.9,14.61 180 top
R51  52.7,10.79 270 top
R52  55.24,10.79 270 top
R53  50.8,33.66 180 bottom
R54  33.02,29.84 0 bottom
R55  33.34,33.97 90 bottom
R56  31.11,14.61 180 top
R57  34.92,10.79 270 top
R58  37.47,10.79 270 top
R59  33.02,33.66 180 bottom
R60  15.24,29.84 0 bottom
R61  15.56,33.97 90 bottom
R62  13.34,14.61 180 top
R63  17.14,10.79 270 top
R64  19.68,10.79 270 top
R65  15.24,33.66 180 bottom
R66  12.06,50.8 270 bottom
R67  13.34,53.34 180 bottom
R68  23.18,50.48 270 bottom
R69  19.37,54.61 180 bottom
R70  25.4,41.27 180 bottom
R71  13.34,39.69 180 bottom
R72  19.05,39.69 90 top
R73  12.7,41.27 0 top
R74  13.34,41.27 0 bottom
R75  12.06,43.81 90 bottom
R76  22.23,41.27 180 bottom
R77  23.5,43.81 90 bottom
R78  14.61,52.07 0 bottom
R79  20.95,52.07 180 bottom
R80  137.79,65.09 90 top
R81  136.21,60.01 0 top
T1  22.23,58.42 270 bottom
T2  37.47,58.42 270 bottom
T3  52.7,58.42 270 bottom
T4  67.94,58.42 270 bottom
T5  125.73,55.24 0 bottom
T6  113.03,58.42 270 bottom
T7  98.42,58.42 270 bottom
T8  83.19,58.42 270 bottom
T9  69.85,30.48 180 bottom
T10  64.14,11.43 180 top
T11  52.07,30.48 180 bottom
T12  46.35,11.43 180 top
T13  34.29,30.48 180 bottom
T14  28.57,11.43 180 top
T15  16.51,30.48 180 bottom
T16  10.79,11.43 180 top
X1  3.81,50.16 90 top
X2  19.05,74.93 0 top
X3  34.29,74.93 0 top
X4  49.53,74.93 0 top
X5  64.77,74.93 0 top
X6  80.01,74.93 0 top
X7  95.25,74.93 0 top
X8  110.49,74.93 0 top
X9  125.73,74.93 0 top
X10  130.81,4.45 180 top
X11  115.57,4.45 180 top
X12  100.33,4.45 180 top
X13  85.09,4.45 180 top
X14  67.31,4.45 180 top
X15  49.53,4.45 180 top
X16  13.97,4.45 180 top
X17  31.75,4.45 180 top
X18  145.73,32.7 270 top
X19  145.73,47.31 270 top

### Tracks (layer width: path | path; a pad name or v marks a point on that pad's centre or on a via)
+3V3  (via drill 0.5 pad 1)
  Top 0.406: v10.79,32.07 v19.68,32.07 | v28.57,32.07 v37.47,32.07 | v46.35,32.07 v55.24,32.07 | v64.14,32.07 v73.03,32.07 | v104.14,26.67 v104.14,36.83 | v98.42,61.28 v98.42,36.9
  Bottom 0.61: R18.2 104.78,60.96 | R21.2 90.17,60.96 | R24.2 74.93,60.96 | R11.2 59.69,60.96 | R8.2 44.45,60.96 | R5.2 29.84,60.96
  Bottom 0.813: R2.2 14.59,60.96 29.84,60.96 44.45,60.96 59.69,60.96 74.93,60.96 90.17,60.96 98.42,60.96 | 120.65,60.96 104.78,60.96 98.42,60.96 | 120.65,60.96 127.64,60.96 133.03,66.36 LM317_3V3.2 | MALE.33 86.36,36.83 98.49,36.83 | 98.49,36.83 v104.14,36.83 | 98.42,60.96 v98.42,61.28 | v98.42,36.9 98.49,36.83 | R15.2 120.65,60.96
  Bottom 1.016: OK12.4 80.64,25.72 81.92,24.45 84.14,24.45 86.36,26.67 91.12,26.67 93.98,23.81 | 93.98,23.81 96.52,23.81 99.38,26.67 v104.14,26.67 106.68,26.67 109.22,24.13 109.54,24.13 | 109.54,24.13 111.76,24.13 114.3,26.67 OK9.4 | OK11.4 93.98,23.81 | OK10.4 109.22,24.45 109.54,24.13 | LM317_3V3.2 R80.2 C12.+
  Bottom 1.27: R42.2 64.14,29.84 | 64.14,29.84 OK14.4 | 46.35,29.84 OK16.4 | R54.2 28.57,29.84 | 28.57,29.84 OK18.4 | OK20.4 10.79,29.84 | 10.79,29.84 v10.79,32.07 | v19.68,32.07 v28.57,32.07 28.57,29.84 | R60.2 10.79,29.84 | v37.47,32.07 v46.35,32.07 46.35,29.84 | R48.2 46.35,29.84 | v55.24,32.07 v64.14,32.07 64.14,29.84 | v73.03,32.07 78.42,26.67 OK12.4
+5V  (via drill 0.5 pad 1)
  Top 0.406: v74.93,47.94 v37.47,47.94 | v146.05,53.98 v136.84,53.98
  Bottom 0.61: IC1.4 17.78,47.94 18.1,47.62 27.62,47.62 29.53,45.72 37.47,45.72 | v37.47,47.94 37.47,45.72 | 37.47,45.72 MALE.2
  Bottom 0.813: v74.93,47.94 106.15,47.94 +5V.MP 109.71,47.94 130.81,47.94 v136.84,53.98 | C10.+ 146.05,57.15
  Bottom 1.016: 7805.OUT 146.05,63.5 146.05,57.15 v146.05,53.98
ANALOG_IN_0
  Bottom 0.61: R73.1 5.03,41.27 X1.3
ANALOG_IN_1
  Bottom 0.813: R72.1 13.02,38.42 6.96,32.36 X1.1
ANALOG_OUT_0
  Bottom 0.61: X1.7 10.75,55.88 20.95,55.88 24.45,52.39 24.45,50.16 24.11,49.83 R68.2 22.93,49.59 IC1.7
ANALOG_OUT_1
  Bottom 0.61: IC1.1 12.06,49.59 | 12.06,49.59 6.88,49.59 X1.5 | R66.2 12.06,49.59
DGND  (via drill 0.5 pad 1)
  Top 0.406: v92.08,29.84 v100.33,29.84 | v107.31,29.84 v115.57,29.84 | v122.56,29.84 v130.81,29.84 | v87.31,29.84 v79.06,29.84 | v21.91,33.66 v21.91,38.1 | v26.67,38.1 v26.67,44.45 | v60.96,35.88 v70.17,35.88 | v47.94,35.88 v55.24,35.88 | v25.4,57.47 v25.4,62.55 | v130.81,66.36 v130.81,61.91
  Bottom 0.61: C9.2 24.75,44.45 24.13,44.45 | 24.13,44.45 R77.2 | R67.1 12.7,53.35 12.7,54.29 13.02,54.61 R69.1 3.49,54.61 1.27,56.83 1.27,66.36 2.86,67.94 3.76,67.94 X1.8 | IC1.11 17.78,46.35 | 17.78,46.35 24.13,46.35 24.13,44.45 | 17.78,46.35 11.43,46.35 11.43,44.45 | 11.43,44.45 C11.2 | 11.43,44.45 R75.2
  Bottom 0.813: R41.1 v92.08,29.84 | v100.33,29.84 v107.31,29.84 | 116.52,29.84 v115.57,29.84 v122.56,29.84 | R65.2 v21.91,33.66 | v21.91,38.1 v26.67,38.1 | v47.94,35.88 46.04,33.66 R59.2 36.2,33.66 37.15,34.61 | v55.24,35.88 v60.96,35.88 | T1.E v25.4,57.47 | v25.4,62.55 10.79,62.55 5.4,67.94 3.81,67.94 X1.8 | C13.2 130.81,72.2 v130.81,66.36 | v130.81,61.91 130.81,55.24
  Bottom 1.016: R47.2 71.12,31.9 T9.E | R53.2 53.34,31.9 T11.E | R59.2 35.56,31.9 T13.E | R65.2 17.78,31.9 T15.E | MALE.34 82.55,45.72 | 7805.GND 148.46,66.36 C14.2
  pour Bottom (isolate 0.61): 0,80.01 0,0 149.86,0 149.86,80.01
IN_0
  Bottom 1.016: R28.2 134.62,5.67 X10.2
IN_1
  Bottom 1.016: R32.2 119.38,5.67 X11.2
IN_2
  Bottom 1.016: R36.2 104.14,5.67 X12.2
IN_3
  Bottom 1.016: R40.2 89.53,6.3 X13.2
IO_0
  Bottom 1.016: R46.2 73.03,7.57 X14.2
IO_1
  Bottom 1.016: R52.2 55.24,7.57 X15.2
IO_2
  Bottom 1.016: R64.2 19.68,7.57 X16.2
IO_3
  Bottom 1.016: R58.2 37.47,7.57 X17.2
MCU_ANALOG_IN_0
  Bottom 0.61: R71.2 28.89,39.69 30.48,41.27 40.96,41.27 41.91,42.23
  Bottom 0.813: 41.91,42.23 MALE.3
MCU_ANALOG_IN_1
  Bottom 0.813: MALE.1 27.95,43.18 R70.2
MCU_ANALOG_OUT_0  (via drill 0.5 pad 1)
  Top 0.406: v19.05,53.34 v25.72,53.34
  Bottom 0.61: IC1.5 v19.05,53.34
  Bottom 0.813: v25.72,53.34 26.35,53.34 27.3,52.39 39.05,52.39 44.45,46.99 MALE.6
MCU_ANALOG_OUT_1  (via drill 0.5 pad 1)
  Top 0.406: v17.14,51.75 v25.72,51.75
  Bottom 0.61: IC1.3 16.51,51.12 v17.14,51.75
  Bottom 0.813: v25.72,51.75 26.67,50.8 37.78,50.8 41.91,46.67 MALE.4
MCU_IN_0
  Bottom 0.813: 127,29.84 127,30.16 125.73,31.43 118.43,31.43 117.16,32.7 103.82,32.7 101.6,34.92 81.6,34.92 75.25,41.27 73.66,41.27 72.39,42.55 MALE.27 | 127,29.84 OK9.3 | R29.2 127,29.84
MCU_IN_1
  Bottom 0.813: 111.76,29.84 111.76,30.16 110.49,31.43 103.19,31.43 100.97,33.66 80.96,33.66 74.61,40.01 72.07,40.01 69.85,42.23 MALE.25 | 111.76,29.84 OK10.3 | R33.2 111.76,29.84
MCU_IN_2
  Bottom 0.813: 96.52,29.84 96.52,30.16 94.3,32.38 80.33,32.38 73.98,38.73 71.12,38.73 67.31,42.55 MALE.23 | 96.52,29.84 OK11.3 | R37.2 96.52,29.84
MCU_IN_3
  Bottom 0.813: 83.19,29.84 83.19,30.48 82.55,31.11 79.69,31.11 73.34,37.47 70.17,37.47 64.77,42.86 MALE.21 | 83.19,29.84 OK12.3 | R41.2 83.19,29.84
MCU_IO_IN_0
  Bottom 0.813: R47.1 59.69,40.01 MALE.17
  Bottom 1.27: OK14.3 66.67,33.02 R47.1
MCU_IO_IN_1
  Bottom 0.813: MALE.13 54.61,41.27 49.53,36.2 49.53,34.29 48.9,33.66 R53.1
  Bottom 1.016: OK16.3 48.9,33.02 R53.1
MCU_IO_IN_2
  Bottom 0.813: R65.1 12.7,34.29 14.92,36.51 28.89,36.51 32.38,40.01 41.91,40.01 44.45,42.55 MALE.5
  Bottom 1.016: OK20.3 13.34,33.02 R65.1
MCU_IO_IN_3
  Bottom 0.813: 30.96,33.18 31.11,33.34 31.11,34.92 33.66,37.47 44.45,37.47 49.53,42.55 MALE.9
  Bottom 1.016: OK18.3 31.11,33.02 30.96,33.18 R59.1
MCU_IO_OUT_0
  Bottom 0.813: R43.2 62.23,41.29 MALE.19
MCU_IO_OUT_1
  Bottom 0.813: R49.2 51.12,35.56 57.15,41.59 MALE.15
MCU_IO_OUT_2
  Bottom 0.813: R61.2 16.18,35.24 29.53,35.24 33.02,38.73 43.18,38.73 46.99,42.55 MALE.7
MCU_IO_OUT_3
  Bottom 0.813: R55.2 34.91,36.2 45.72,36.2 52.07,42.55 MALE.11
MCU_OUT_0
  Bottom 0.813: R4.2 40.01,53.98 46.99,46.99 MALE.8
MCU_OUT_1
  Bottom 0.813: R7.2 42.86,53.98 49.53,47.31 MALE.10
MCU_OUT_2
  Bottom 0.813: R10.2 52.07,50.16 MALE.12
MCU_OUT_3
  Bottom 0.813: R13.2 58.42,53.98 54.61,50.16 MALE.14
MCU_OUT_4
  Bottom 0.61: R17.2 103.82,52.39 102.55,51.12 90.49,51.12 89.22,49.85 73.98,49.85 72.71,48.58 65.72,48.58 64.77,47.62 MALE.22
MCU_OUT_5
  Bottom 0.61: R20.2 103.82,53.98 102.23,52.39 90.17,52.39 88.9,51.12 73.66,51.12 72.39,49.85 63.5,49.85 62.23,48.58 MALE.20
MCU_OUT_6
  Bottom 0.61: R23.2 90.17,53.98 88.58,52.39 73.34,52.39 72.07,51.12 61.28,51.12 59.69,49.53 MALE.18
MCU_OUT_7
  Bottom 0.61: R26.2 73.34,53.98 71.75,52.39 59.05,52.39 57.15,50.48 MALE.16
N$1
  Bottom 1.016: OK1.2 19.68,58.42 T1.C
N$2
  Bottom 1.016: T2.C 34.92,58.42 OK2.2
N$3
  Bottom 1.016: T1.B 27.94,59.37 R4.1
N$4
  Bottom 0.61: R2.1 16.5,59.04 OK1.1
N$5
  Bottom 1.016: T2.B 42.23,59.37 R7.1
N$6
  Bottom 0.61: R5.1 31.73,59.04 OK2.1
N$7
  Bottom 1.016: T3.C 50.16,58.42 OK3.2
N$8
  Bottom 1.016: T3.B 55.56,59.37 R10.1
N$9
  Bottom 0.61: R8.1 46.98,59.04 OK3.1
N$10
  Bottom 1.016: T4.C 65.41,58.42 OK4.2
N$11
  Bottom 1.016: T4.B 70.81,59.37 R13.1
N$12
  Bottom 0.61: R11.1 62.22,59.04 OK4.1
N$13
  Bottom 1.016: T5.C OK5.2
N$14
  Bottom 0.813: T5.B 126.68,53.02 R17.1
N$15
  Bottom 0.61: R15.1 123.17,59.04 OK5.1
N$16
  Bottom 1.016: T6.C 110.49,58.42 OK6.2
N$17
  Bottom 1.016: T6.B 115.89,59.37 R20.1
N$18
  Bottom 0.61: R18.1 OK6.1
N$19
  Bottom 1.016: T7.C 95.89,58.42 OK7.2
N$20
  Bottom 1.016: T7.B 101.28,59.37 R23.1
N$21
  Bottom 0.61: R21.1 92.69,59.04 OK7.1
N$22
  Bottom 1.016: T8.C 80.64,58.42 OK8.2
N$23
  Bottom 1.016: T8.B 87.63,59.37 R26.1
N$24
  Bottom 0.61: R24.1 77.45,59.04 OK8.1
N$25
  Bottom 1.016: OK9.1 R14.1 R27.2
N$26
  Bottom 1.016: Q1.C OK9.2
N$27
  Bottom 1.016: Q1.B R28.1
N$28
  Bottom 1.016: R31.2 R30.1 OK10.1
N$29
  Bottom 1.016: OK10.2 Q2.C 111.76,12.7
N$30
  Bottom 1.016: Q2.B R32.1
N$31
  Bottom 1.016: OK11.1 R34.1 R35.2
N$32
  Bottom 1.016: OK11.2 Q3.C
N$33
  Bottom 1.016: R36.1 Q3.B
N$34
  Bottom 1.016: R39.2 R38.1 OK12.1
N$35
  Bottom 1.016: Q4.C OK12.2
N$36
  Bottom 1.016: R40.1 84.45,11.43 85.72,12.7 Q4.B
N$37
  Bottom 1.016: T10.C OK14.2
N$38
  Bottom 1.016: T9.C 69.85,26.67 OK13.2
N$39
  Bottom 0.813: T9.B R43.1
N$40
  Bottom 1.27: R42.1 73.03,29.21 OK13.1
N$41
  Bottom 1.27: OK13.3 70.48,14.61 | 70.48,14.61 R45.1 R46.1 | R44.1 70.48,14.61
N$42
  Bottom 1.27: OK14.1 R44.2
N$43
  Bottom 1.016: T10.B 64.14,10.16 65.41,8.89 69.85,8.89 R45.2
N$44
  Bottom 1.016: T12.C OK16.2
N$45
  Bottom 1.016: T11.C 52.07,26.67 OK15.2
N$46
  Bottom 0.813: R49.1 T11.B
N$47
  Bottom 1.27: R48.1 55.24,29.21 OK15.1
N$48
  Bottom 1.27: OK15.3 52.7,14.61 | 52.7,14.61 R51.1 R52.1 | R50.1 52.7,14.61
N$49
  Bottom 1.27: OK16.1 R50.2
N$50
  Bottom 1.016: R51.2 52.07,8.89 47.62,8.89 46.35,10.16 T12.B
N$51
  Bottom 1.016: OK18.2 T14.C
N$52
  Bottom 1.016: T13.C 34.29,26.67 OK17.2
N$53
  Bottom 0.813: T13.B R55.1
N$54
  Bottom 1.27: R54.1 37.47,29.21 OK17.1
N$55
  Bottom 1.27: OK17.3 34.92,14.61 | 34.92,14.61 R57.1 R58.1 | R56.1 34.92,14.61
N$56
  Bottom 1.27: OK18.1 R56.2
N$57
  Bottom 1.016: R57.2 34.29,8.89 29.84,8.89 28.57,10.16 T14.B
N$58
  Bottom 1.016: T16.C OK20.2
N$59
  Bottom 1.016: T15.C 16.51,26.67 OK19.2
N$60
  Bottom 0.813: R61.1 T15.B
N$61
  Bottom 1.27: R60.1 19.68,29.21 OK19.1
N$62
  Bottom 1.27: OK19.3 17.14,14.61 | 17.14,14.61 R63.1 R64.1 | R62.1 17.14,14.61
N$63
  Bottom 1.27: OK20.1 R62.2
N$64
  Bottom 1.016: R63.2 16.51,8.89 12.06,8.89 10.79,10.16 T16.B
N$65
  Bottom 0.61: IC1.6 20.32,52.07 R79.1 20.3,54.32 R69.2
N$66
  Bottom 0.61: IC1.2 15.24,52.07 R78.1 15.26,53.34 R67.2
N$67
  Bottom 0.61: IC1.10 R72.2
N$68
  Bottom 0.61: IC1.12 R73.2
N$69
  Bottom 0.61: IC1.9 20.95,44.39 | 20.95,44.39 IC1.8 | R76.1 20.95,41.9 20.95,44.39
N$70
  Bottom 0.61: R19.1 112.39,69.85
  Bottom 1.27: J_GND6.1 113.03,64.77 | 113.03,64.77 J_GND7.2 | X8.3 113.01,69.85 | 113.01,69.85 113.01,64.79 113.03,64.77 | 112.39,69.85 113.01,69.85
N$71
  Bottom 0.61: IC1.13 14.61,44.39 | 14.61,44.39 IC1.14 | R74.1 14.61,41.9 14.61,44.39
N$72
  Bottom 0.61: R77.1 24.13,43.16 | 24.13,43.16 C9.1 | R76.2 22.89,41.29 R70.1 24.13,41.29 24.13,43.16
N$73
  Bottom 0.61: R74.2 12.67,41.29 11.43,41.29 | R75.1 C11.1 11.43,43.16 11.43,41.29 | 11.43,41.29 11.43,40.32 12.06,39.69 R71.1
N$74
  Bottom 0.61: R66.1 12.69,52.07 R78.2
N$75
  Bottom 0.61: R79.2 22.24,52.07 R68.1
N$76
  Bottom 0.61: 21.57,74.26 X2.3 | R3.1 21.59,69.85
  Bottom 1.27: J_GND.1 21.59,64.77 21.59,69.85 21.59,73.71 X2.3
N$77
  Bottom 0.61: R6.1 36.83,69.85
  Bottom 1.27: J_GND.2 36.83,64.77 | J_GND1.1 36.83,64.77 | 36.83,64.77 36.83,69.85 36.83,73.71 X3.3
N$78
  Bottom 1.27: J_POW.2 29.84,68.58 OK2.4 31.75,69.85 X3.1 29.16,77.47 38.1,77.47 39.37,76.2 J_POW1.1
N$79
  Bottom 1.27: J_POW1.2 45.09,68.58 OK3.4 46.99,69.85 X4.1 44.4,77.47 53.34,77.47 54.61,76.2 J_POW2.1
N$80
  Bottom 0.61: R9.1 52.07,69.85
  Bottom 1.27: J_GND1.2 52.07,64.77 | X4.3 52.07,73.71 52.07,69.85 52.07,64.77 | J_GND2.1 52.07,64.77
N$81
  Bottom 1.27: J_POW2.2 60.33,68.58 OK4.4 62.23,69.85 X5.1 59.64,77.47 68.26,77.47 69.85,75.88 J_POW3.1
N$82
  Bottom 0.61: R12.1 67.31,69.85
  Bottom 1.27: J_GND2.2 67.31,64.77 | 67.31,64.77 J_GND3.1 | X5.3 67.31,73.71 67.31,69.85 67.31,64.77
N$83
  Bottom 1.016: X11.3 116.84,8.21 Q2.E 116.84,16.51 114.3,19.05 114.3,20.95 114.62,21.27 | J_GND8.1 108.27,21.27 114.62,21.27 | 114.62,21.27 115.25,21.27 J_GND4.2
N$84
  Bottom 1.016: X13.3 86.36,8.21 86.36,10.16 88.27,12.06 Q4.E 88.27,15.88 85.09,19.05 85.09,22.86 86.36,24.13 J_GND9.2
N$85
  Bottom 0.61: R25.1 82.55,69.85
  Bottom 1.27: J_GND3.2 82.55,64.77 | X6.3 82.55,73.71 82.55,69.85 82.55,64.77 | 82.55,64.77 J_GND5.2
N$86
  Bottom 1.27: J_POW3.2 75.56,68.58 OK8.4 77.47,69.85 X6.1 74.88,77.47 83.82,77.47 85.09,76.2 J_POW5.2
N$87
  Bottom 1.27: J_POW5.1 90.81,68.58 OK7.4 92.71,69.85 X7.1 90.12,77.47 99.06,77.47 100.33,76.2 J_POW6.2
N$88
  Bottom 0.61: R22.1 97.79,69.85
  Bottom 1.27: J_GND5.1 97.79,64.77 | X7.3 97.79,73.71 97.79,69.85 97.79,64.77 | J_GND6.2 97.79,64.77
N$89
  Bottom 1.27: J_POW6.1 105.41,68.58 OK6.4 107.31,70.49 X8.1 105.36,77.47 113.98,77.47 115.57,75.88 J_POW7.2
N$90
  Bottom 1.27: X9.1 123.19,69.85 OK5.4 121.28,68.58 J_POW7.1
N$91
  Bottom 1.016: R38.2 R39.1 78.11,10.16 80.01,8.26 80.01,3.17 81.28,1.91 90.22,1.91 X13.1 92.71,4.44 92.71,9.84 89.85,12.7 89.85,16.83 87.63,19.05 J_POW9.2
N$92
  Bottom 1.016: 109.06,11.27 110.49,9.84 110.49,3.17 111.76,1.91 120.7,1.91 X11.1 123.19,4.44 123.19,9.21 119.38,13.02 119.38,17.46 118.11,18.73 J_POW4.2 | 109.06,11.27 106.68,13.65 R30.2 106.68,19.05 J_POW8.1 | R31.1 109.06,11.27
N$93
  Bottom 1.016: X12.3 101.6,8.21 Q3.E 101.6,16.51 99.06,19.05 99.06,20.95 98.74,21.27 | J_GND9.1 93.03,21.27 98.74,21.27 | 98.74,21.27 100.01,21.27 J_GND8.2
N$94
  Bottom 0.61: R16.1 128.27,69.85
  Bottom 1.27: J_GND7.1 128.27,64.77 128.27,69.85 128.27,73.71 X9.3
N$95
  Bottom 1.016: 93.82,11.27 91.44,13.65 R34.2 91.44,19.05 J_POW9.1 | 93.82,11.27 95.25,9.84 95.25,3.17 96.52,1.91 105.46,1.91 X12.1 107.95,4.44 107.95,9.53 104.14,13.34 104.14,17.46 102.87,18.73 J_POW8.2 | R35.1 93.82,11.27
N$96
  Bottom 1.016: X10.3 132.08,8.21 Q1.E 132.08,19.05 127,24.13 J_GND4.1
N$97
  Bottom 1.016: X10.1 135.94,1.91 127,1.91 125.73,3.17 125.73,9.84 124.3,11.27 | 124.3,11.27 121.92,13.65 R14.2 121.92,19.05 J_POW4.1 | R27.1 124.3,11.27
N$98
  Bottom 1.016: X17.1 39.39,16.49 OK17.4 37.47,23.5 | J_POW13.1 26.04,23.5 37.47,23.5 | 37.47,23.5 40.01,23.5 J_POW11.2
N$99
  Bottom 1.016: T16.E 8.26,7.62 X16.3 13.65,2.22 22.86,2.22 24.13,3.49 24.13,17.78 22.86,19.05 J_GND13.2
N$100
  Bottom 1.016: X14.1 74.95,16.49 OK13.4 73.03,20.64 70.17,23.5 61.59,23.5 J_POW10.1
N$101
  Bottom 1.27: OK1.4 16.51,69.85 X2.1 13.92,77.47 22.86,77.47 24.13,76.2 J_POW.1
N$102
  Bottom 1.016: J_GND10.1 61.59,19.68 T10.E 61.59,7.62 X14.3
N$103
  Bottom 1.016: X15.1 57.17,16.49 OK15.4 55.24,23.18 55.56,23.5 | J_POW11.1 43.81,23.5 55.56,23.5 | 55.56,23.5 57.78,23.5 J_POW10.2
N$104
  Bottom 1.016: J_GND11.1 43.81,19.68 T12.E 43.81,7.62 X15.3 49.21,2.22 58.42,2.22 59.69,3.49 59.69,17.78 58.42,19.05 J_GND10.2
N$105
  Bottom 1.016: J_GND13.1 26.04,19.68 T14.E 26.04,7.62 X17.3 31.43,2.22 40.64,2.22 41.91,3.49 41.91,17.78 40.64,19.05 J_GND11.2
N$106
  Bottom 1.016: X16.1 21.61,16.49 OK19.4 19.68,22.86 20.95,24.13 J_POW13.2
N$107
  Bottom 1.778: X18.2 136.19,30.18 AC1.MP
N$108
  Bottom 1.778: X18.1 140.38,40.64 AC2.MP
N$110  (via drill 0.5 pad 1)
  Top 0.406: v143.51,68.9 v143.51,61.91
  Bottom 1.016: LM317_3V3.3 137.79,68.9 | 137.79,68.9 v143.51,68.9 7805.IN 148.46,68.9 C14.1 | C13.1 137.79,68.9 | X19.1 143.51,52.12 v143.51,61.91
N$111
  Bottom 0.813: 137.79,60.33 R81.2
  Bottom 1.016: LM317_3V3.1 R80.1 137.79,60.33
OUT_0
  Bottom 0.61: R3.2 19.05,69.85
  Bottom 1.27: OK1.3 19.05,69.85 19.05,72.39 X2.2
OUT_1
  Bottom 0.61: R6.2 34.29,69.85
  Bottom 1.27: OK2.3 34.29,69.85 34.29,72.39 X3.2
OUT_2
  Bottom 0.61: R9.2 49.53,69.85
  Bottom 1.27: OK3.3 49.53,69.85 49.53,72.39 X4.2
OUT_3
  Bottom 0.61: R12.2 64.77,69.85
  Bottom 1.27: OK4.3 64.77,69.85 64.77,72.39 X5.2
OUT_4
  Bottom 0.61: R16.2 125.73,69.85
  Bottom 1.27: OK5.3 125.73,69.85 125.73,72.39 X9.2
OUT_5
  Bottom 0.61: R19.2 109.86,69.85
  Bottom 1.27: OK6.3 109.86,69.85 109.86,73.03 X8.2
OUT_6
  Bottom 0.61: R22.2 95.25,69.85
  Bottom 1.27: OK7.3 95.25,69.85 95.25,72.39 X7.2
OUT_7
  Bottom 0.61: R25.2 80.01,69.85
  Bottom 1.27: OK8.3 80.01,69.85 80.01,72.39 X6.2